# EAGLE schematic Hello (EAGLE 8.5.0)
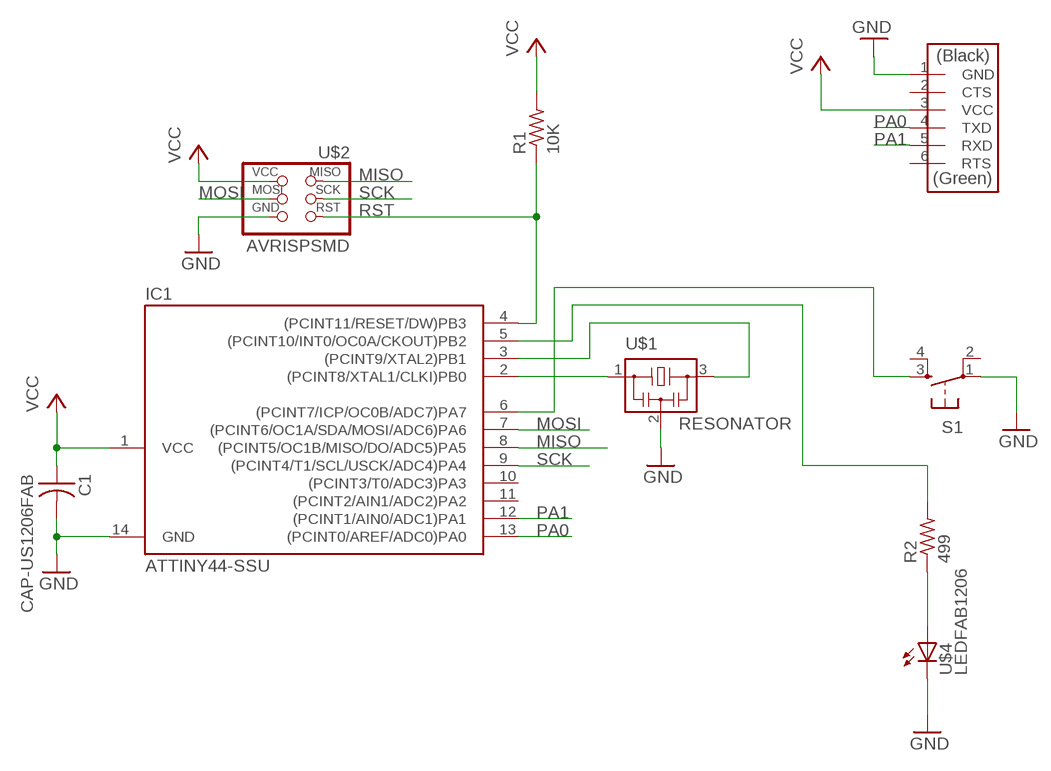
[diagram p0: schematic, sheet 1]

## Parts
C1  CAP-US1206FAB  [C1206FAB]
IC1  ATTINY44-SSU  [SOIC14]
R1  10K  RES-US1206FAB  [R1206FAB]
R2  499  RES-US1206FAB  [R1206FAB]
S1  6MM_SWITCH6MM_SWITCH  [6MM_SWITCH]
U$1  RESONATOR  [EFOBM]
U$2  AVRISPSMD  [2X03SMD]
U$3  FTDI-SMD-HEADER  [1X06SMD]
U$4  LEDFAB1206  [LED1206FAB]

## Nets
GND: C1.2 IC1.14(GND) S1.1(P) U$1.2 U$2.6(GND) U$3.1(GND) U$4.2(C)
MISO: IC1.8((PCINT5/OC1B/MISO/DO/ADC5)PA5) U$2.1(MISO)
MOSI: IC1.7((PCINT6/OC1A/SDA/MOSI/ADC6)PA6) U$2.4(MOSI)
N$1: IC1.2((PCINT8/XTAL1/CLKI)PB0) U$1.1
N$2: IC1.3((PCINT9/XTAL2)PB1) U$1.3
N$3: R2.1 U$4.1(A)
N$4: IC1.6((PCINT7/ICP/OC0B/ADC7)PA7) S1.3(S)
N$5: IC1.5((PCINT10/INT0/OC0A/CKOUT)PB2) R2.2
PA0: IC1.13((PCINT0/AREF/ADC0)PA0) U$3.4(TXD)
PA1: IC1.12((PCINT1/AIN0/ADC1)PA1) U$3.5(RXD)
RST: IC1.4((PCINT11/RESET/DW)PB3) R1.1 U$2.5(RST)
SCK: IC1.9((PCINT4/T1/SCL/USCK/ADC4)PA4) U$2.3(SCK)
VCC: C1.1 IC1.1(VCC) R1.2 U$2.2(VCC) U$3.3(VCC)
Unconnected: IC1.10((PCINT3/T0/ADC3)PA3) IC1.11((PCINT2/AIN1/ADC2)PA2) S1.2(P1) S1.4(S1) U$3.2(CTS) U$3.6(RTS)

## Library data of the parts
C1 = fab:CAP-US
IC1 = fab:ATTINY44
R1 R2 = fab:RES-US: Resistor (US Symbol) Variants with postfix FAB are widened to allow the routing of internal traces
S1 = fab:6MM_SWITCH: OMRON SWITCH
U$1 = fab:RESONATOR
U$2 = fab:AVRISP
U$3 = fab:FTDI-SMD-HEADER
U$4 = fab:LED: LED

## Net classes
0 default: clearance 0.205 mm